# Altium schematic sheet Load.SchDoc
size A; SheetNumber: 1; SheetTotal: 1
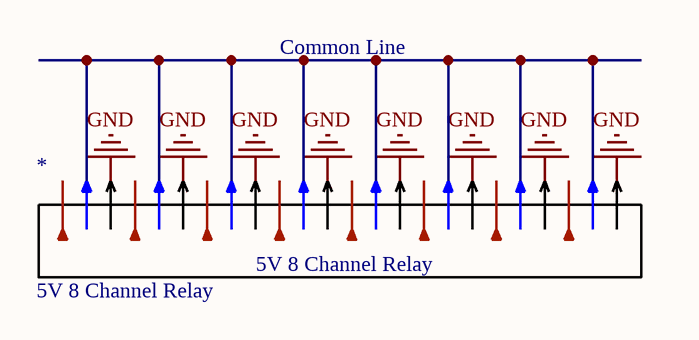
[diagram p0: Load.SchDoc]

## Parts
*  5V 8 Channel Relay

## Notes on the sheet
- Common Line
- Labels drawn without touching a wire or pin: GND